# Altium project STM32F407VG.PrjPCB
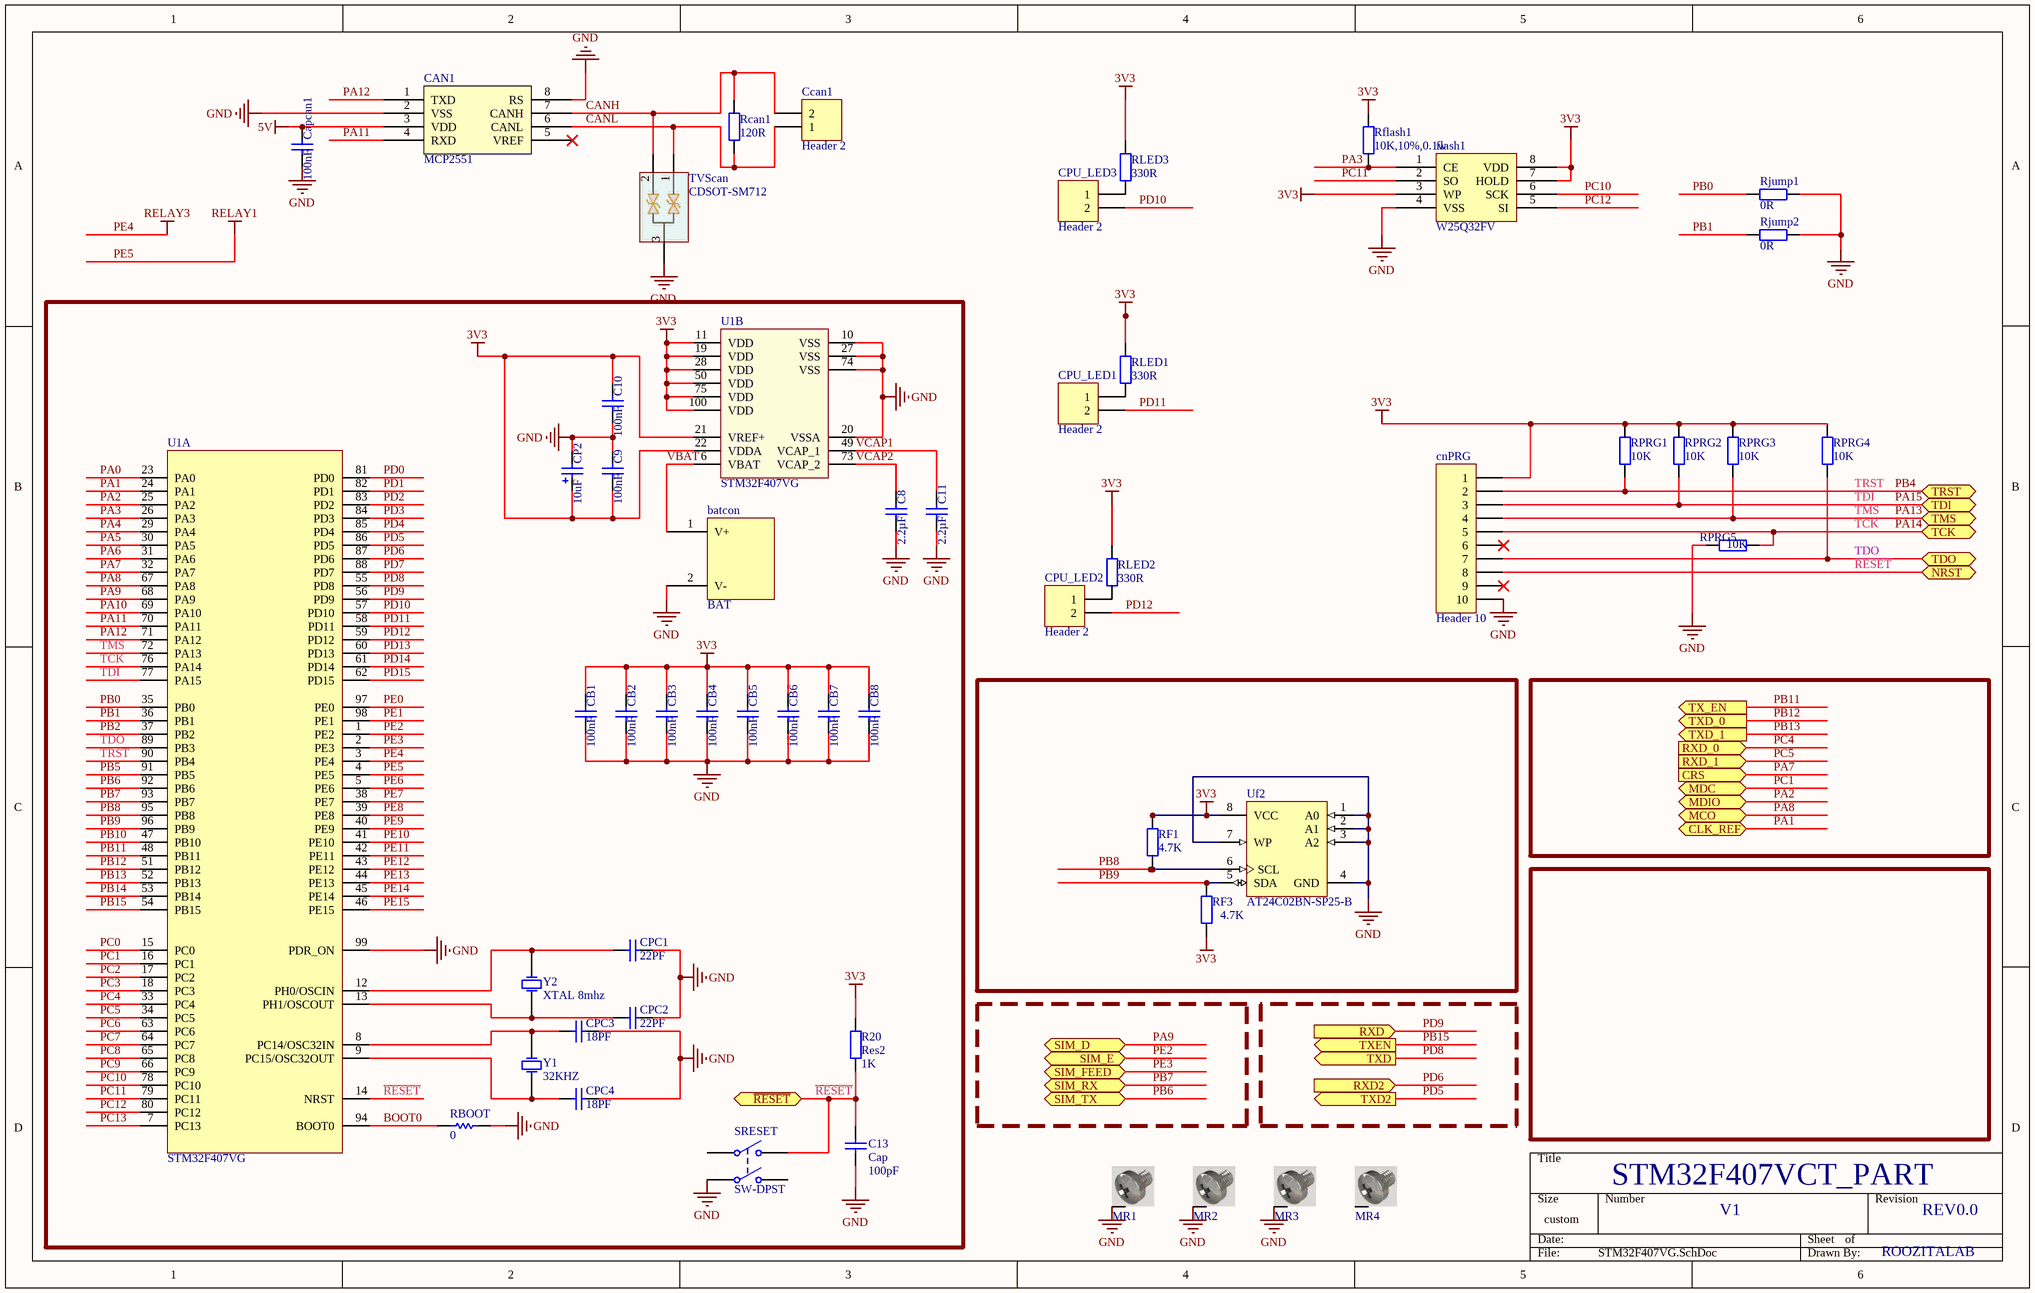
[diagram p0: STM32F407VG.SchDoc]
6 sheets, 157 parts. Net scope: flat (ports and power ports of the same name join across sheets).
Board file: CORTEXM4.PcbDoc
Sheets:
  STM32F407VG.SchDoc
  POWER_PART.SchDoc
  PROTOCOL_PART.SchDoc
  ETH_PART.SchDoc
  SIM800.SchDoc
  OUTPUTS.SchDoc

## Sheet STM32F407VG.SchDoc
size 381 x 241 mm

### Parts
batcon  BAT  [BATTERY]
C8  2.2µF  [0805.]
C9  100nF  [0805.]
C10  100nF  [0805.]
C11  2.2µF  [0805.]
C13  Cap  value 100pF  [0805.]
CAN1  MCP2551  [SOIC8]
Capcan1  100nF  [0805.]
CB1  100nF  [0805.]
CB2  100nF  [0805.]
CB3  100nF  [0805.]
CB4  100nF  [0805.]
CB5  100nF  [0805.]
CB6  100nF  [0805.]
CB7  100nF  [0805.]
CB8  100nF  [0805.]
Ccan1  Header 2  [HDR1X2]
cnPRG  Header 10  [HDR1X10]
CP2  10uF  [C1206.]
CPC1  22PF  [0805.]
CPC2  22PF  [0805.]
CPC3  18PF  [0805.]
CPC4  18PF  [0805.]
CPU_LED1  Header 2  [HDR1X2]
CPU_LED2  Header 2  [HDR1X2]
CPU_LED3  Header 2  [HDR1X2]
flash1  W25Q32FV  [SOIC8]
MR1  Screw  [Board Screw]  (value not drawn)
MR2  Screw  [Board Screw]  (value not drawn)
MR3  Screw  [Board Screw]  (value not drawn)
MR4  Screw  [Board Screw]  (value not drawn)
R20  Res2  value 1K  [0805.]
RBOOT  0  [0805.]
Rcan1  value 120R  [0805.]  (hidden comment: 120R,10%,0.1w)
RF1  value 4.7K  [0805.]  (hidden comment: Res2)
RF3  value 4.7K  [0805.]  (hidden comment: Res2)
Rflash1  10K,10%,0.1w  [0805.]
Rjump1  value 0R  [0805.]  (hidden comment: 10K,10%,0.1w)
Rjump2  value 0R  [0805.]  (hidden comment: 10K,10%,0.1w)
RLED1  value 330R  [0805.]  (hidden comment: 330R,10%,0.1w)
RLED2  value 330R  [0805.]  (hidden comment: 330R,10%,0.1w)
RLED3  value 330R  [0805.]  (hidden comment: 330R,10%,0.1w)
RPRG1  value 10K  [0805.]  (hidden comment: Res2)
RPRG2  value 10K  [0805.]  (hidden comment: Res2)
RPRG3  value 10K  [0805.]  (hidden comment: Res2)
RPRG4  value 10K  [0805.]  (hidden comment: Res2)
RPRG5  value 10K  [0805.]  (hidden comment: Res2)
SRESET  SW-DPST  [B3FS_SWITCH]
TVScan  CDSOT-SM712  [2N3906_SMD]
U1  STM32F407VG  [stm32f107]  (parts A,B of 2)
Uf2  AT24C02BN-SP25-B  [SOP8]
Y1  32KHZ  [XTAL-RTC-RA]
Y2  XTAL 8mhz  [XTAL Small]

### Ports
CLK_REF (bidir), CRS (in), MCO (bidir), MDC (bidir), MDIO (bidir), NRST (bidir), RXD2 (in), RXD (in), RXD_0 (in), RXD_1 (in), SIM_D (bidir), SIM_E (bidir), SIM_FEED (bidir), SIM_RX (bidir), SIM_TX (bidir), TCK (bidir), TDI (bidir), TDO (bidir), TMS (bidir), TRST (bidir), TX_EN (out), TXD2 (out), TXD (out), TXD_0 (out), TXD_1 (out), TXEN (out), ~{RESET} (bidir)

### Nets
3V3: C9.1 C10.2 CB1.2 CB2.2 CB3.2 CB4.2 CB5.2 CB6.2 CB7.2 CB8.2 cnPRG.1 CP2.1 flash1.3(WP) flash1.7(HOLD) flash1.8(VDD) R20.2 RF1.1 RF3.2 Rflash1.1 RLED1.2 RLED2.2 RLED3.2 RPRG1.1 RPRG2.1 RPRG3.1 RPRG4.1 U1.11(VDD) U1.19(VDD) U1.21(VREF+) U1.22(VDDA) U1.28(VDD) U1.50(VDD) U1.75(VDD) U1.100(VDD) Uf2.8(VCC)
5V: CAN1.3(VDD) Capcan1.2  [project net +5V]
GND: batcon.2(V-) C8.1 C9.2 C10.1 C11.1 C13.1 CAN1.2(VSS) CAN1.8(RS) Capcan1.1 CB1.1 CB2.1 CB3.1 CB4.1 CB5.1 CB6.1 CB7.1 CB8.1 cnPRG.10 CP2.2 CPC1.2 CPC2.2 CPC3.2 CPC4.2 flash1.4(VSS) MR1.S MR2.S MR3.S RBOOT.2 Rjump1.2 Rjump2.2 RPRG5.2 SRESET.3(COMMON2) TVScan.3 U1.10(VSS) U1.20(VSSA) U1.27(VSS) U1.74(VSS) U1.99(PDR_ON) Uf2.1(A0) Uf2.2(A1) Uf2.3(A2) Uf2.4(GND) Uf2.7(WP)
PE4: U1.3(PE4)  [also labelled RELAY3]
PE5: U1.4(PE5)  [also labelled RELAY1]
~{RESET}: C13.2 cnPRG.8 R20.1 SRESET.2(NO1) U1.14(NRST) ; port ~{RESET}, port NRST
BOOT0: RBOOT.1 U1.94(BOOT0)
CANH: CAN1.7(CANH) Ccan1.2 Rcan1.2 TVScan.2
CANL: CAN1.6(CANL) Ccan1.1 Rcan1.1 TVScan.1
PA0: U1.23(PA0)
PA1: U1.24(PA1) ; port CLK_REF
PA2: U1.25(PA2) ; port MDIO
PA3: flash1.1(CE) Rflash1.2 U1.26(PA3)
PA4: U1.29(PA4)
PA5: U1.30(PA5)
PA6: U1.31(PA6)
PA7: U1.32(PA7) ; port CRS
PA8: U1.67(PA8) ; port MCO
PA9: U1.68(PA9) ; port SIM_D
PA10: U1.69(PA10)
PA11: CAN1.4(RXD) U1.70(PA11)
PA12: CAN1.1(TXD) U1.71(PA12)
PA13: cnPRG.4 RPRG3.2 U1.72(PA13) ; port TMS  [also labelled TMS]
PA14: cnPRG.5 RPRG5.1 U1.76(PA14) ; port TCK  [also labelled TCK]
PA15: cnPRG.3 RPRG2.2 U1.77(PA15) ; port TDI  [also labelled TDI]
PB0: Rjump1.1 U1.35(PB0)
PB1: Rjump2.1 U1.36(PB1)
PB2: U1.37(PB2)
PB4: cnPRG.2 RPRG1.2 U1.90(PB4) ; port TRST  [also labelled TRST]
PB5: U1.91(PB5)
PB6: U1.92(PB6) ; port SIM_TX
PB7: U1.93(PB7) ; port SIM_RX
PB8: RF1.2 U1.95(PB8) Uf2.6(SCL)
PB9: RF3.1 U1.96(PB9) Uf2.5(SDA)
PB10: U1.47(PB10)
PB11: U1.48(PB11) ; port TX_EN
PB12: U1.51(PB12) ; port TXD_0
PB13: U1.52(PB13) ; port TXD_1
PB14: U1.53(PB14)
PB15: U1.54(PB15) ; port TXEN
PC0: U1.15(PC0)
PC1: U1.16(PC1) ; port MDC
PC2: U1.17(PC2)
PC3: U1.18(PC3)
PC4: U1.33(PC4) ; port RXD_0
PC5: U1.34(PC5) ; port RXD_1
PC6: U1.63(PC6)
PC7: U1.64(PC7)
PC8: U1.65(PC8)
PC9: U1.66(PC9)
PC10: flash1.6(SCK) U1.78(PC10)
PC11: flash1.2(SO) U1.79(PC11)
PC12: flash1.5(SI) U1.80(PC12)
PC13: U1.7(PC13)
PD0: U1.81(PD0)
PD1: U1.82(PD1)
PD2: U1.83(PD2)
PD3: U1.84(PD3)
PD4: U1.85(PD4)
PD5: U1.86(PD5) ; port TXD2
PD6: U1.87(PD6) ; port RXD2
PD7: U1.88(PD7)
PD8: U1.55(PD8) ; port TXD
PD9: U1.56(PD9) ; port RXD
PD10: CPU_LED3.2 U1.57(PD10)
PD11: CPU_LED1.2 U1.58(PD11)
PD12: CPU_LED2.2 U1.59(PD12)
PD13: U1.60(PD13)
PD14: U1.61(PD14)
PD15: U1.62(PD15)
PE0: U1.97(PE0)
PE1: U1.98(PE1)
PE2: U1.1(PE2) ; port SIM_E
PE3: U1.2(PE3) ; port SIM_FEED
PE6: U1.5(PE6)
PE7: U1.38(PE7)
PE8: U1.39(PE8)
PE9: U1.40(PE9)
PE10: U1.41(PE10)
PE11: U1.42(PE11)
PE12: U1.43(PE12)
PE13: U1.44(PE13)
PE14: U1.45(PE14)
PE15: U1.46(PE15)
TDO: cnPRG.7 RPRG4.2 U1.89(PB3) ; port TDO
VBAT: batcon.1(V+) U1.6(VBAT)
VCAP1: C11.2 U1.49(VCAP_1)
VCAP2: C8.2 U1.73(VCAP_2)
NetCPC1_1: CPC1.1 U1.12(PH0/OSCIN) Y2.2(OSC2)
NetCPC2_1: CPC2.1 U1.13(PH1/OSCOUT) Y2.1(OSC1)
NetCPC3_1: CPC3.1 U1.8(PC14/OSC32IN) Y1.2(OSC2)
NetCPC4_1: CPC4.1 U1.9(PC15/OSC32OUT) Y1.1(OSC1)
NetCPU_LED1_1: CPU_LED1.1 RLED1.1
NetCPU_LED2_1: CPU_LED2.1 RLED2.1
NetCPU_LED3_1: CPU_LED3.1 RLED3.1

Not connected (* = marked no-connect by the designer): CAN1 5(VREF)*; cnPRG 6* 9*; MR4 S; SRESET 1(COMMON1) 4(NO2)

### Notes on the sheet
- STM32F407VCT_PART
- V1
- REV0.0
- ROOZITALAB

### Library data of the parts
C8-C11 C13 Capcan1 CB1-CB8 CPC1-CPC4 = Cap: Capacitor; Published: 8-Jun-2000; LatestRevisionDate: 17-Jul-2002; LatestRevisionNote: Re-released for DXP Platform.; PackageReference: RAD-0.3; Publisher: Altium Limited; PackageDescription: Radial Cap, Thru-Hole; 2 Leads; 0.3 in Pin Spacing
  C8 C11: Value: 2.2µF
  C9 C10 Capcan1 CB1-CB8: Value: 100nF
  CPC1 CPC2: Value: 22PF
  CPC3 CPC4: Value: 18PF
CAN1 = SN65VHD230
Ccan1 CPU_LED1-CPU_LED3 = Header 2: Header, 2-Pin; LatestRevisionDate: 17-Jul-2002; LatestRevisionNote: Re-released for DXP Platform.; Publisher: Altium Limited
cnPRG = Header 10: Header, 10-Pin; LatestRevisionDate: 17-Jul-2002; LatestRevisionNote: Re-released for DXP Platform.; Publisher: Altium Limited
CP2 = Cap Pol1: Polarized Capacitor (Radial); Published: 8-Jun-2000; Revision: July-2002: Re-released for DXP Platform.; Publisher: Altium Limited; Value: 10uF
flash1 = SST25
MR1-MR4 = Board Screw: Board Screw With Spacer
R20 Rcan1 RF1 RF3 Rflash1 Rjump1 Rjump2 RLED1-RLED3 RPRG1-RPRG5 = Res2: Resistor; Published: 8-Jun-2000; LatestRevisionDate: 17-Jul-2002; LatestRevisionNote: Re-released for DXP Platform.; PackageReference: AXIAL-0.4; Publisher: Altium Limited
  R20 RF1 RF3 Rjump1 Rjump2 RPRG1-RPRG5: PackageDescription: Axial Device, Thru-Hole; 2 Leads; 0.4 in Pin Spacing
RBOOT = Res1: Resistor; Value: 1K; Published: 8-Jun-2000; Revision: July-2002: Re-released for DXP Platform.; Publisher: Altium Limited
SRESET = SW-DPST: Double-Pole, Single-Throw Switch; Published: 24-Mar-1999; LatestRevisionDate: 17-Jul-2002; LatestRevisionNote: Re-released for DXP Platform.; PackageReference: DPST-4; Publisher: Altium Limited
TVScan = nup2105
Uf2 = AT24C02BN-SP25-B: 2Kbit (256 x 8), 2-wire Bus Automotive Serial EEPROM with full memory Write Protect, 2.5V, 8-Pin SOIC, Bulk; Published: 20-Sep-2010; DatasheetVersion: 8517C,  Jan-2009; PackageVersion: revC, Mar-2005; PackageReference: 8S1; Publisher: Altium Limited; PackageDescription: 8-Lead (0.150" Wide Body), Plastic Gull Wing Small Outline (JEDEC SOIC); Code_JEDEC: MS-012-AA; Code_IPC: SOIC127P600-8; ComponentLink1Description: Manufacturer Link; ComponentLink1URL: http://www.atmel.com/products/serial/default.asp; ComponentLink2Description: Datasheet; ComponentLink2URL: http://www.atmel.com/dyn/resources/prod_documents/doc8517.pdf; ComponentLink3Description: Atmel.com Home; ComponentLink3URL: http://www.atmel.com
Y1 = XTAL_1: Crystal Oscillator; Published: 8-Jun-2000; LatestRevisionDate: 17-Jul-2002; LatestRevisionNote: Re-released for DXP Platform.; PackageReference: R38; Publisher: Altium Limited
Y2 = XTAL: Crystal Oscillator; Published: 8-Jun-2000; LatestRevisionDate: 17-Jul-2002; LatestRevisionNote: Re-released for DXP Platform.; PackageReference: R38; Publisher: Altium Limited

## Sheet POWER_PART.SchDoc
size A4
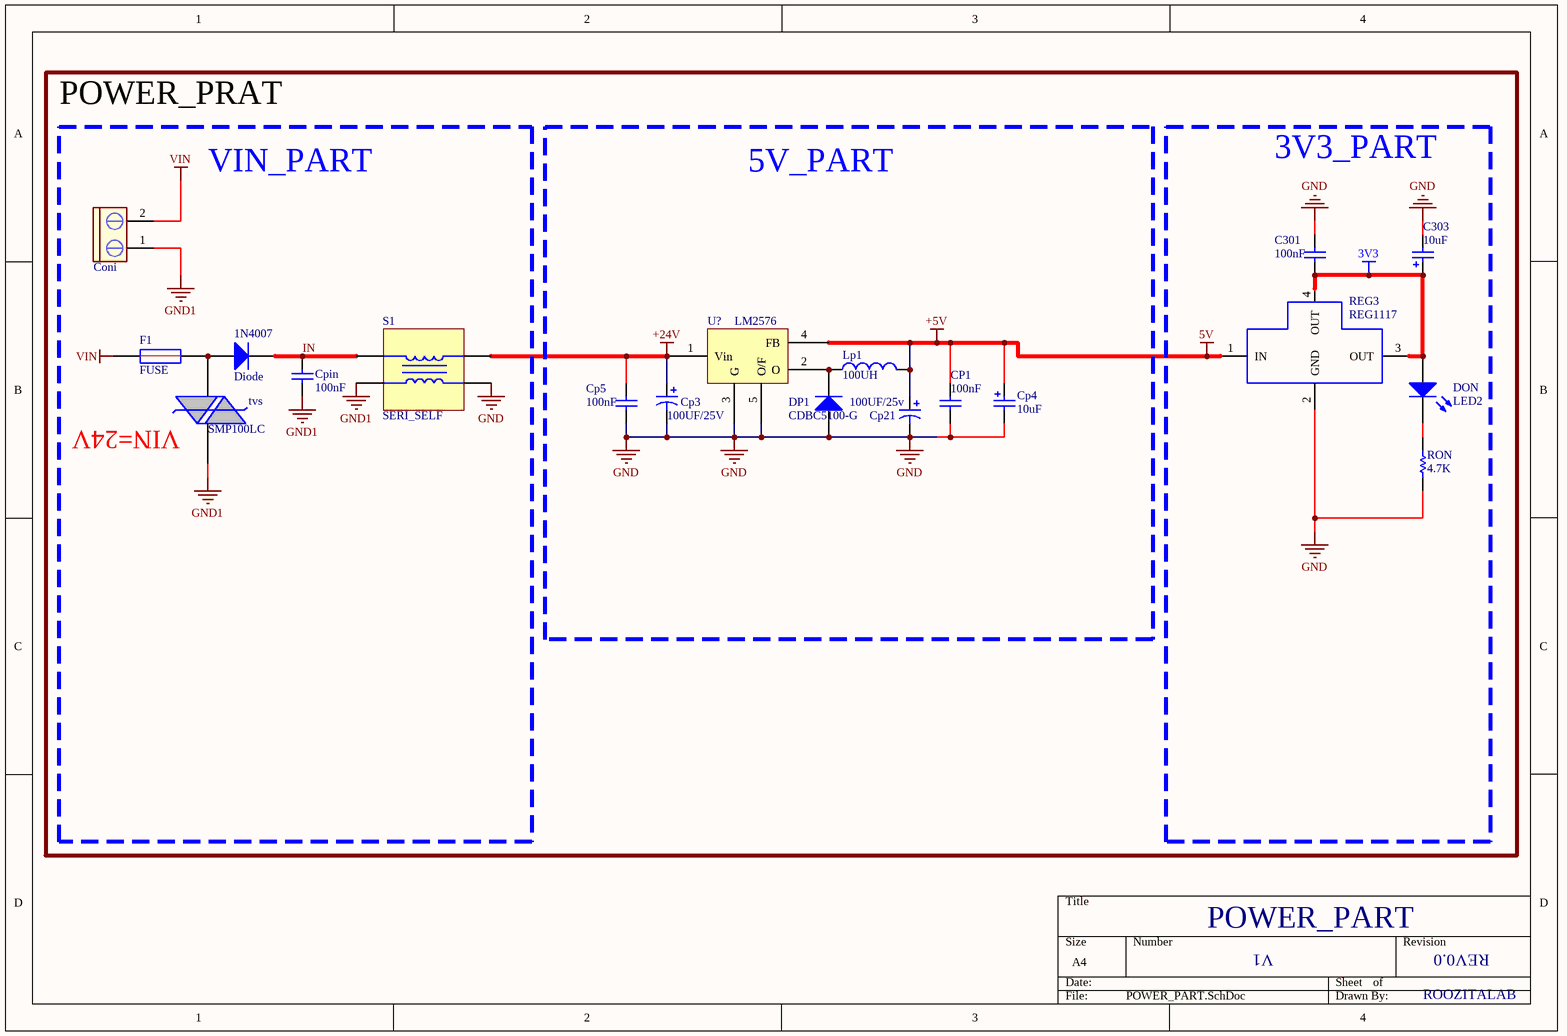
[diagram p1: POWER_PART.SchDoc]

### Parts
1N4007  Diode  [SMB]
C301  100nF  [0805.]
C303  10uF  [C1206.]
Coni  CON2 pin blue  [My_CN2]  (value not drawn)
CP1  100nF  [0805.]
Cp3  value 100UF/25V  [100UF25V]  (hidden comment: Cap Pol1)
Cp4  10uF  [C1206.]
Cp5  100nF  [0805.]
Cp21  value 100UF/25v  [100UF25V]  (hidden comment: Cap Pol1)
Cpin  100nF  [0805.]
DON  LED2  [0805.]
DP1  CDBC5100-G  [MY_SMC]
F1  FUSE  [1206]
Lp1  value 100UH  [indoctor100u]  (hidden comment: Inductor)
REG3  REG1117  [REG SMD]
RON  4.7K  [0805.]
S1  SERI_SELF  [SERI_SELF_SMALL]
tvs  SMP100LC  [TVS]
U?  LM2576  [d2pak5-lead]

### Nets
3V3: C301.1 C303.1 DON.1(A) REG3.3(OUT) REG3.4(OUT)
+5V: CP1.2 Cp4.1 Cp21.1 Lp1.2 REG3.1(IN) U?.4(FB)  [also labelled 5V]
+24V: Cp3.1 Cp5.2 S1.3 U?.1(Vin)
GND: C301.2 C303.2 CP1.1 Cp3.2 Cp4.2 Cp5.1 Cp21.2 DP1.A REG3.2(GND) RON.1 S1.4 U?.3(G) U?.5(O/F)
GND1: Coni.1 Cpin.2 S1.2 tvs.2
VIN: Coni.2 F1.2
IN: 1N4007.2(K) Cpin.1 S1.1
Net1N4007_1: 1N4007.1(A) F1.1 tvs.1
NetDON_2: DON.2(K) RON.2
NetDP1_K: DP1.K Lp1.1 U?.2(O)

### Notes on the sheet
- POWER_PRAT
- VIN_PART
- 5V_PART
- 3V3_PART
- (near tvs) VIN=24V
- POWER_PART
- V1
- REV0.0
- ROOZITALAB

### Library data of the parts
1N4007 = Diode: Default Diode; Published: 8-Jun-2000; LatestRevisionDate: 17-Jul-2002; LatestRevisionNote: Re-released for DXP Platform.; PackageVersion: Sep-1996; PackageReference: SMC; Publisher: Altium Limited; PackageDescription: DO-214-AB/SMC; 2 C-Bend Leads; Body 7.9 x 5.9 mm, inc. leads (LxW); Code_JEDEC: DO-214-AB
C301 CP1 Cp5 Cpin = Cap: Capacitor; Published: 8-Jun-2000; LatestRevisionDate: 17-Jul-2002; LatestRevisionNote: Re-released for DXP Platform.; PackageReference: RAD-0.3; Publisher: Altium Limited; PackageDescription: Radial Cap, Thru-Hole; 2 Leads; 0.3 in Pin Spacing; Value: 100nF
C303 Cp3 Cp4 Cp21 = Cap Pol1: Polarized Capacitor (Radial); Published: 8-Jun-2000; Publisher: Altium Limited
  C303 Cp4: Revision: July-2002: Re-released for DXP Platform.; Value: 10uF
  Cp3 Cp21: LatestRevisionDate: 17-Jul-2002; LatestRevisionNote: Re-released for DXP Platform.; PackageReference: RB7.6-15
Coni = CON2 pin blue: Connector blue screw
DON = LED2: Typical RED, GREEN, YELLOW, AMBER GaAs LED; Published: 8-Jun-2000; LatestRevisionDate: 17-Jul-2002; LatestRevisionNote: Re-released for DXP Platform.; PackageVersion: Feb-2002; PackageReference: 3.2X1.6X1.1; Publisher: Altium Limited; PackageDescription: SM LED; 2 Flat Leads
DP1 = 1N4007: 1 Amp Diode
Lp1 = Inductor: Code_IEC: 1005; Published: 8-Jun-2000; LatestRevisionDate: 17-Jul-2002; LatestRevisionNote: Re-released for DXP Platform.; PackageReference: 0402-A; Publisher: Altium Limited; Code_JEITA: 0402
RON = Res1: Resistor; Value: 1K; Published: 8-Jun-2000; Revision: July-2002: Re-released for DXP Platform.; Publisher: Altium Limited
U? = LM2576-5V

## Sheet PROTOCOL_PART.SchDoc
size A
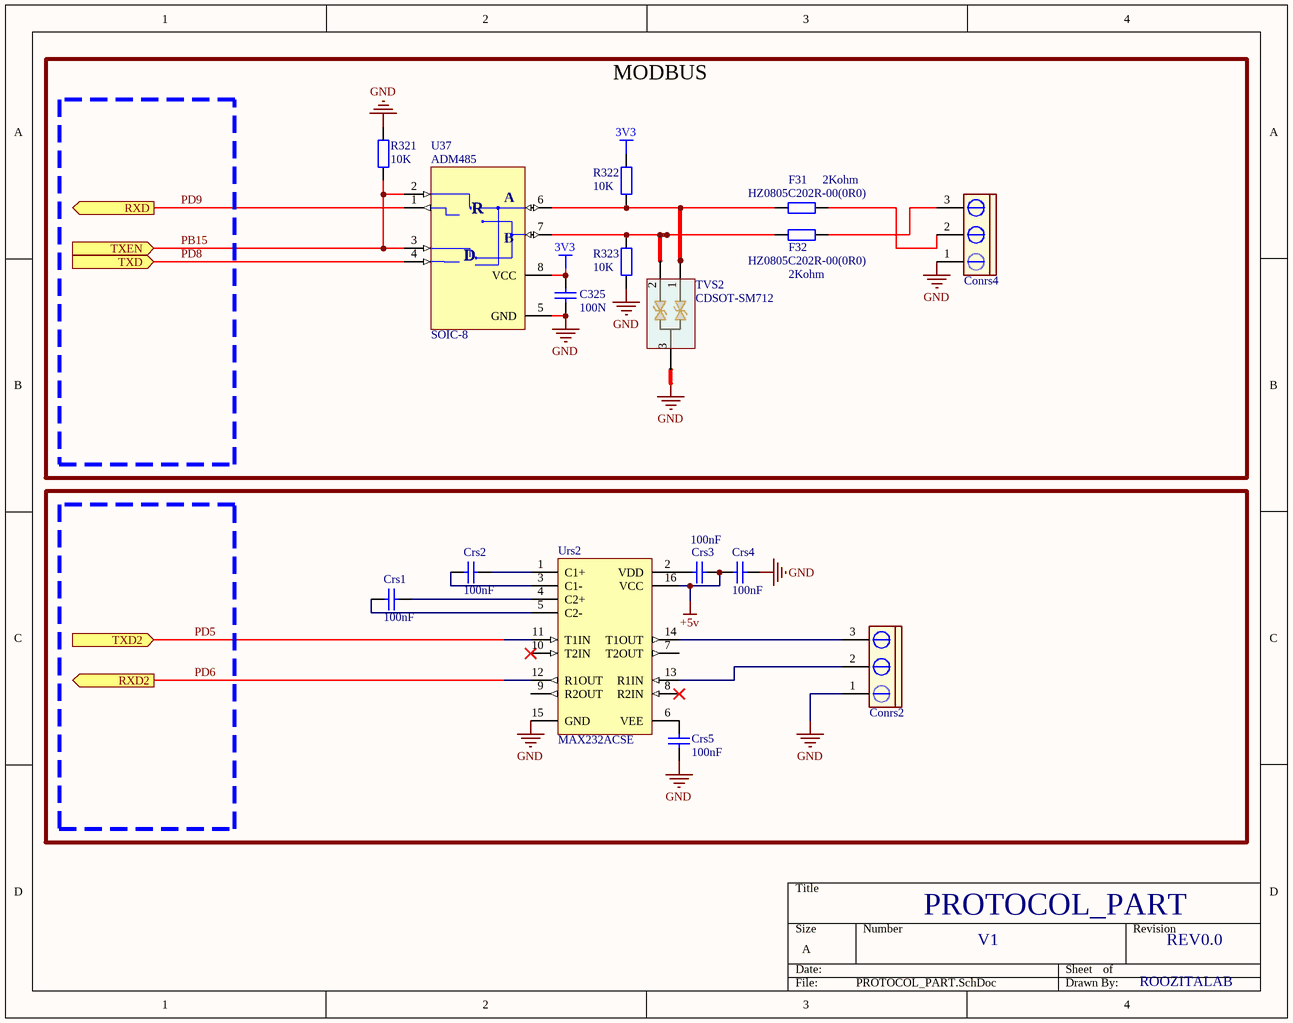
[diagram p2: PROTOCOL_PART.SchDoc]

### Parts
C325  value 100N  [0805.]
Conrs2  CON3 pin Green  [My_CN3]  (value not drawn)
Conrs4  CON3 pin Green  [My_CN3]  (value not drawn)
Crs1  value 100nF  [CAP 1206 (3216X08L)]  (hidden comment: Cap)
Crs2  value 100nF  [CAP 1206 (3216X08L)]  (hidden comment: Cap)
Crs3  value 100nF  [CAP 1206 (3216X08L)]  (hidden comment: Cap)
Crs4  value 100nF  [CAP 1206 (3216X08L)]  (hidden comment: Cap)
Crs5  value 100nF  [CAP 1206 (3216X08L)]  (hidden comment: Cap)
F31  HZ0805C202R-00(0R0)  [0805.]
F32  HZ0805C202R-00(0R0)  [0805.]
R321  value 10K  [0805.]
R322  value 10K  [0805.]
R323  value 10K  [0805.]
TVS2  CDSOT-SM712  [2N3906_SMD]
U37  ADM485  [SOIC8]
Urs2  MAX232ACSE  [SOIC16]

### Blocks framed on the sheet
MODBUS: C325 Conrs4 F31 F32 R321-R323 TVS2 U37

### Ports
RXD2 (out), RXD (out), TXD2 (in), TXD (in), TXEN (in)

### Nets
3V3: C325.2 R322.1 U37.8(VCC)
+5V: Crs3.1 Crs4.2 Urs2.16(VCC)
GND: C325.1 Conrs2.1 Conrs4.1 Crs4.1 Crs5.1 R321.1 R323.2 TVS2.3 U37.5(GND) Urs2.15(GND)
PB15: R321.2 U37.2(~{RE}) U37.3(DE) ; port TXEN
PD5: Urs2.11(T1IN) ; port TXD2
PD6: Urs2.12(R1OUT) ; port RXD2
PD8: U37.4(DI) ; port TXD
PD9: U37.1(RO) ; port RXD
NetConrs2_2: Conrs2.2 Urs2.13(R1IN)
NetConrs2_3: Conrs2.3 Urs2.14(T1OUT)
NetConrs4_2: Conrs4.2 F31.2
NetConrs4_3: Conrs4.3 F32.2
NetCrs1_1: Crs1.1 Urs2.5(C2-)
NetCrs1_2: Crs1.2 Urs2.4(C2+)
NetCrs2_1: Crs2.1 Urs2.1(C1+)
NetCrs2_2: Crs2.2 Urs2.3(C1-)
NetCrs3_2: Crs3.2 Urs2.2(VDD)
NetCrs5_2: Crs5.2 Urs2.6(VEE)
NetF31_1: F31.1 R322.2 TVS2.1 U37.6(A)
NetF32_1: F32.1 R323.1 TVS2.2 U37.7(B)

Not connected (* = marked no-connect by the designer): Urs2 7(T2OUT) 8(R2IN)* 9(R2OUT) 10(T2IN)*

### Notes on the sheet
- (near F31) 2Kohm
- (near F32) 2Kohm
- (near U37) SOIC-8
- PROTOCOL_PART
- V1
- REV0.0
- ROOZITALAB
- (in symbol MAX485EPA) R; D

### Library data of the parts
C325 = Cap: Capacitor; Manufacturer: Generic Components; Class: Passive; Published: 08/06/2000; Publisher: Altium Hobart Technology Centre; SubClass: Capacitor
Conrs2 Conrs4 = CON3 pin Green: Connector green screw
Crs1-Crs5 = Cap: Capacitor; Published: 8-Jun-2000; LatestRevisionDate: 17-Jul-2002; LatestRevisionNote: Re-released for DXP Platform.; PackageReference: RAD-0.3; Publisher: Altium Limited
F31 F32 = Res2: Resistor; Published: 8-Jun-2000; Revision: July-2002: Re-released for DXP Platform.; Publisher: Altium Limited
R321-R323 = Res2: Resistor; Manufacturer: Generic Components; Class: Passive; Published: 08/06/2000; Publisher: Altium Hobart Technology Centre; SubClass: Resistor
TVS2 = nup2105
U37 = MAX485EPA: Low-Power, Slew-Rate-Limited RS-485/RS-422 Transceiver; Manufacturer: Maxim; Class: Communication; Published: 16/01/2001; Publisher: Altium Hobart Technology Centre; SubClass: Transceiver
Urs2 = MAX232ACSE: +5V Powered, Multi-Channel RS-232 Driver/Receiver; Published: 16-Jan-2001; LatestRevisionDate: 13-Apr-2006; LatestRevisionNote: IPC-7351 Footprint Added.; PackageReference: NSO16; Publisher: Altium Limited; PackageDescription: 16-Pin Small Outline Integrated Circuit 1.27 mm Pitch; Code_JEDEC: MS-012-AC; Code_IPC: SOIC127P600-16; ComponentLink1Description: Manufacturer Link; ComponentLink1URL: http://www.maxim-ic.com/; ComponentLink2Description: Datasheet; ComponentLink2URL: http://pdfserv.maxim-ic.com/en/ds/MAX220-MAX249.pdf

## Sheet ETH_PART.SchDoc
size A4; SheetTotal: 8
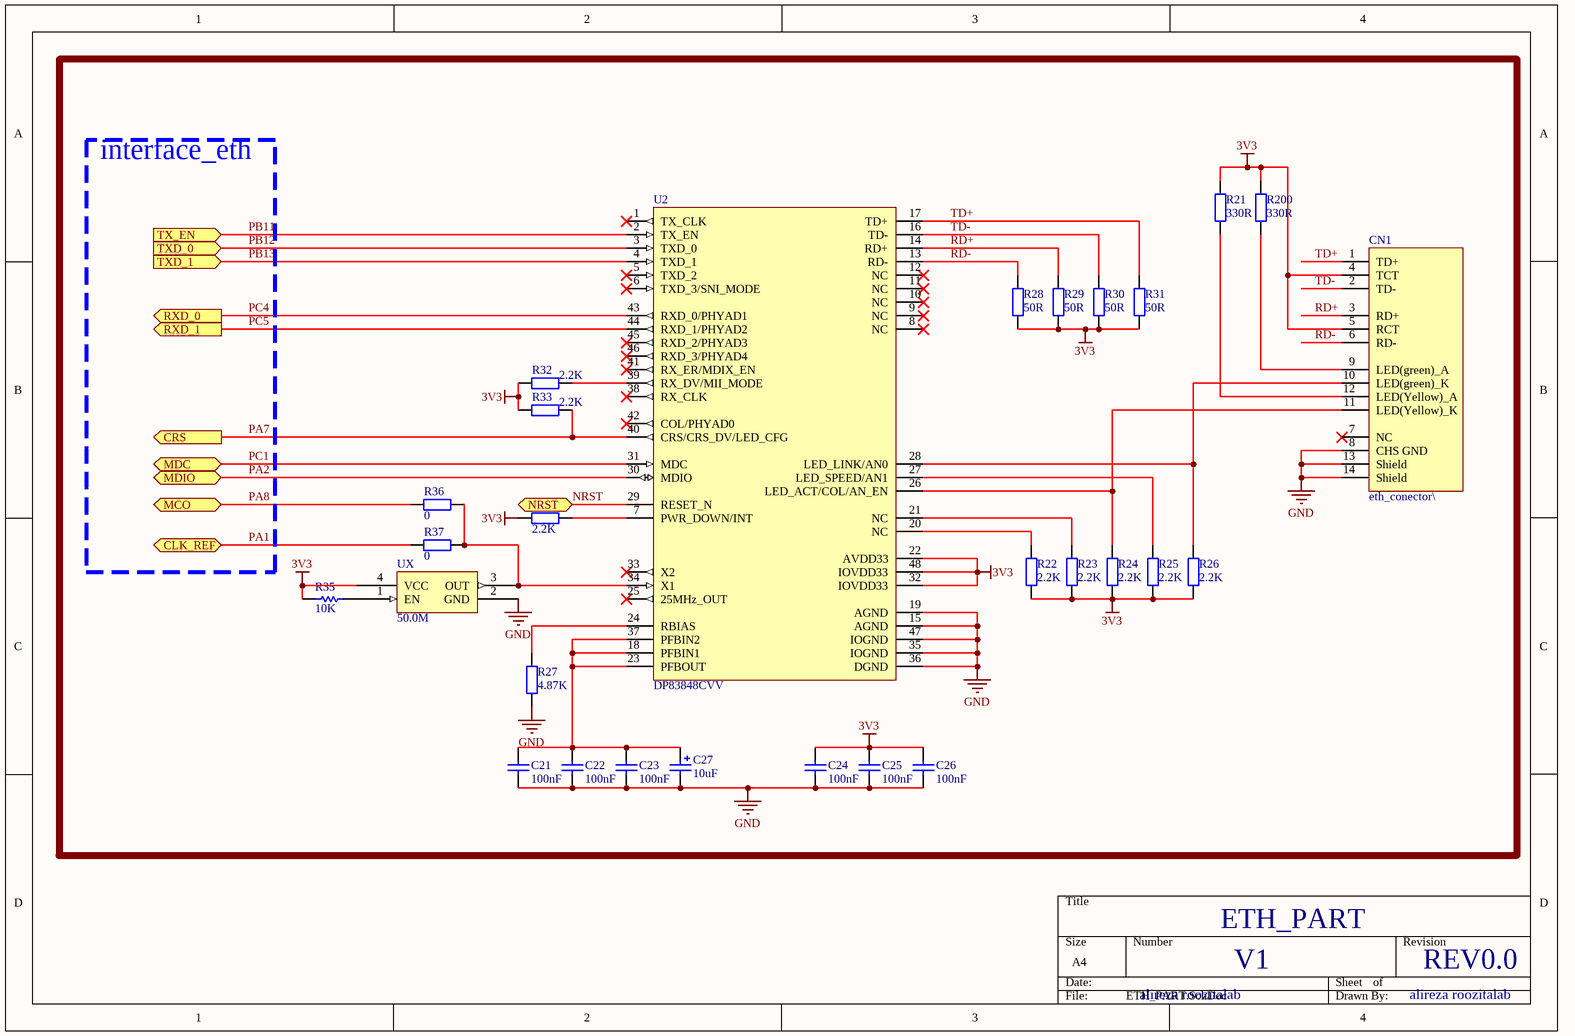
[diagram p3: ETH_PART.SchDoc]

### Parts
C21  100nF  [0805.]
C22  100nF  [0805.]
C23  100nF  [0805.]
C24  100nF  [0805.]
C25  100nF  [0805.]
C26  100nF  [0805.]
C27  10uF  [C1206.]
CN1  eth_conector\  [eth_conector]
R21  value 330R  [0805.]  (hidden comment: Res2)
R22  value 2.2K  [0805.]  (hidden comment: Res2)
R23  value 2.2K  [0805.]  (hidden comment: Res2)
R24  value 2.2K  [0805.]  (hidden comment: Res2)
R25  value 2.2K  [0805.]  (hidden comment: Res2)
R26  value 2.2K  [0805.]  (hidden comment: Res2)
R27  value 4.87K  [0805.]  (hidden comment: Res2)
R28  value 50R  [0805.]  (hidden comment: Res2)
R29  value 50R  [0805.]  (hidden comment: Res2)
R30  value 50R  [0805.]  (hidden comment: Res2)
R31  value 50R  [0805.]  (hidden comment: Res2)
R32  value 2.2K  [0805.]  (hidden comment: Res2)
R33  value 2.2K  [0805.]  (hidden comment: Res2)
R34  value 2.2K  [0805.]  (hidden comment: Res2)
R35  10K  [0805.]
R36  value 0  [0805.]  (hidden comment: Res2)
R37  value 0  [0805.]  (hidden comment: Res2)
R200  value 330R  [0805.]  (hidden comment: Res2)
U2  DP83848CVV  [LQFP48]
UX  50.0M  [oscillator_50MHZ]

### Blocks framed on the sheet
interface_eth: C21-C27 CN1 R21-R37 R200 U2 UX

### Ports
CLK_REF (bidir), CRS (out), MCO (bidir), MDC (bidir), MDIO (bidir), NRST (bidir), RXD_0 (out), RXD_1 (out), TX_EN (in), TXD_0 (in), TXD_1 (in)

### Nets
3V3: C24.1 C25.1 C26.1 CN1.4(TCT) CN1.5(RCT) R21.2 R22.1 R23.1 R24.1 R25.1 R26.1 R28.1 R29.1 R30.1 R31.1 R32.1 R33.1 R34.1 R35.1 R200.2 U2.22(AVDD33) U2.32(IOVDD33) U2.48(IOVDD33) UX.4(VCC)
GND: C21.2 C22.2 C23.2 C24.2 C25.2 C26.2 C27.2 CN1.8(CHS_GND) CN1.13(Shield) CN1.14(Shield) R27.1 U2.15(AGND) U2.19(AGND) U2.35(IOGND) U2.36(DGND) U2.47(IOGND) UX.2(GND)
NRST: U2.29(RESET_N) ; port NRST  [project net ~{RESET}]
PA1: R37.1 ; port CLK_REF
PA2: U2.30(MDIO) ; port MDIO
PA7: R33.2 U2.40(CRS/CRS_DV/LED_CFG) ; port CRS
PA8: R36.1 ; port MCO
PB11: U2.2(TX_EN) ; port TX_EN
PB12: U2.3(TXD_0) ; port TXD_0
PB13: U2.4(TXD_1) ; port TXD_1
PC1: U2.31(MDC) ; port MDC
PC4: U2.43(RXD_0/PHYAD1) ; port RXD_0
PC5: U2.44(RXD_1/PHYAD2) ; port RXD_1
RD+: CN1.3(RD+) R29.2 U2.14(RD+)
RD-: CN1.6(RD-) R28.2 U2.13(RD-)
TD+: CN1.1(TD+) R31.2 U2.17(TD+)
TD-: CN1.2(TD-) R30.2 U2.16(TD-)
NetC21_1: C21.1 C22.1 C23.1 C27.1 U2.18(PFBIN1) U2.23(PFBOUT) U2.37(PFBIN2)
NetCN1_9: CN1.9(LED(green)_A) R200.1
NetCN1_10: CN1.10(LED(green)_K) R26.2 U2.28(LED_LINK/AN0)
NetCN1_11: CN1.11(LED(Yellow)_K) R24.2 U2.26(LED_ACT/COL/AN_EN)
NetCN1_12: CN1.12(LED(Yellow)_A) R21.1
NetR22_2: R22.2 U2.20(NC)
NetR23_2: R23.2 U2.21(NC)
NetR25_2: R25.2 U2.27(LED_SPEED/AN1)
NetR27_2: R27.2 U2.24(RBIAS)
NetR32_2: R32.2 U2.39(RX_DV/MII_MODE)
NetR34_2: R34.2 U2.7(PWR_DOWN/INT)
NetR35_2: R35.2 UX.1(EN)
NetR36_2: R36.2 R37.2 U2.34(X1) UX.3(OUT)

Not connected (* = marked no-connect by the designer): CN1 7(NC)*; U2 1(TX_CLK)* 5(TXD_2)* 6(TXD_3/SNI_MODE)* 8(NC)* 9(NC)* 10(NC)* 11(NC)* 12(NC)* 25(25MHz_OUT)* 33(X2)* 38(RX_CLK)* 41(RX_ER/MDIX_EN)* 42(COL/PHYAD0)* 45(RXD_2/PHYAD3)* 46(RXD_3/PHYAD4)*

### Notes on the sheet
- ETH_PART
- V1
- REV0.0
- alireza roozitalab

### Library data of the parts
C21-C26 = Cap: Capacitor; Published: 8-Jun-2000; LatestRevisionDate: 17-Jul-2002; LatestRevisionNote: Re-released for DXP Platform.; PackageReference: RAD-0.3; Publisher: Altium Limited; PackageDescription: Radial Cap, Thru-Hole; 2 Leads; 0.3 in Pin Spacing; Value: 100nF
C27 = Cap Pol1: Polarized Capacitor (Radial); Published: 8-Jun-2000; Revision: July-2002: Re-released for DXP Platform.; Publisher: Altium Limited; Value: 10uF
R21-R34 R36 R37 R200 = Res2: Resistor; Published: 8-Jun-2000; LatestRevisionDate: 17-Jul-2002; LatestRevisionNote: Re-released for DXP Platform.; PackageReference: AXIAL-0.4; Publisher: Altium Limited; PackageDescription: Axial Device, Thru-Hole; 2 Leads; 0.4 in Pin Spacing
R35 = Res1: Resistor; Value: 1K; Published: 8-Jun-2000; Revision: July-2002: Re-released for DXP Platform.; Publisher: Altium Limited
UX = SM7745HEV-50.0M

## Sheet SIM800.SchDoc
size A3
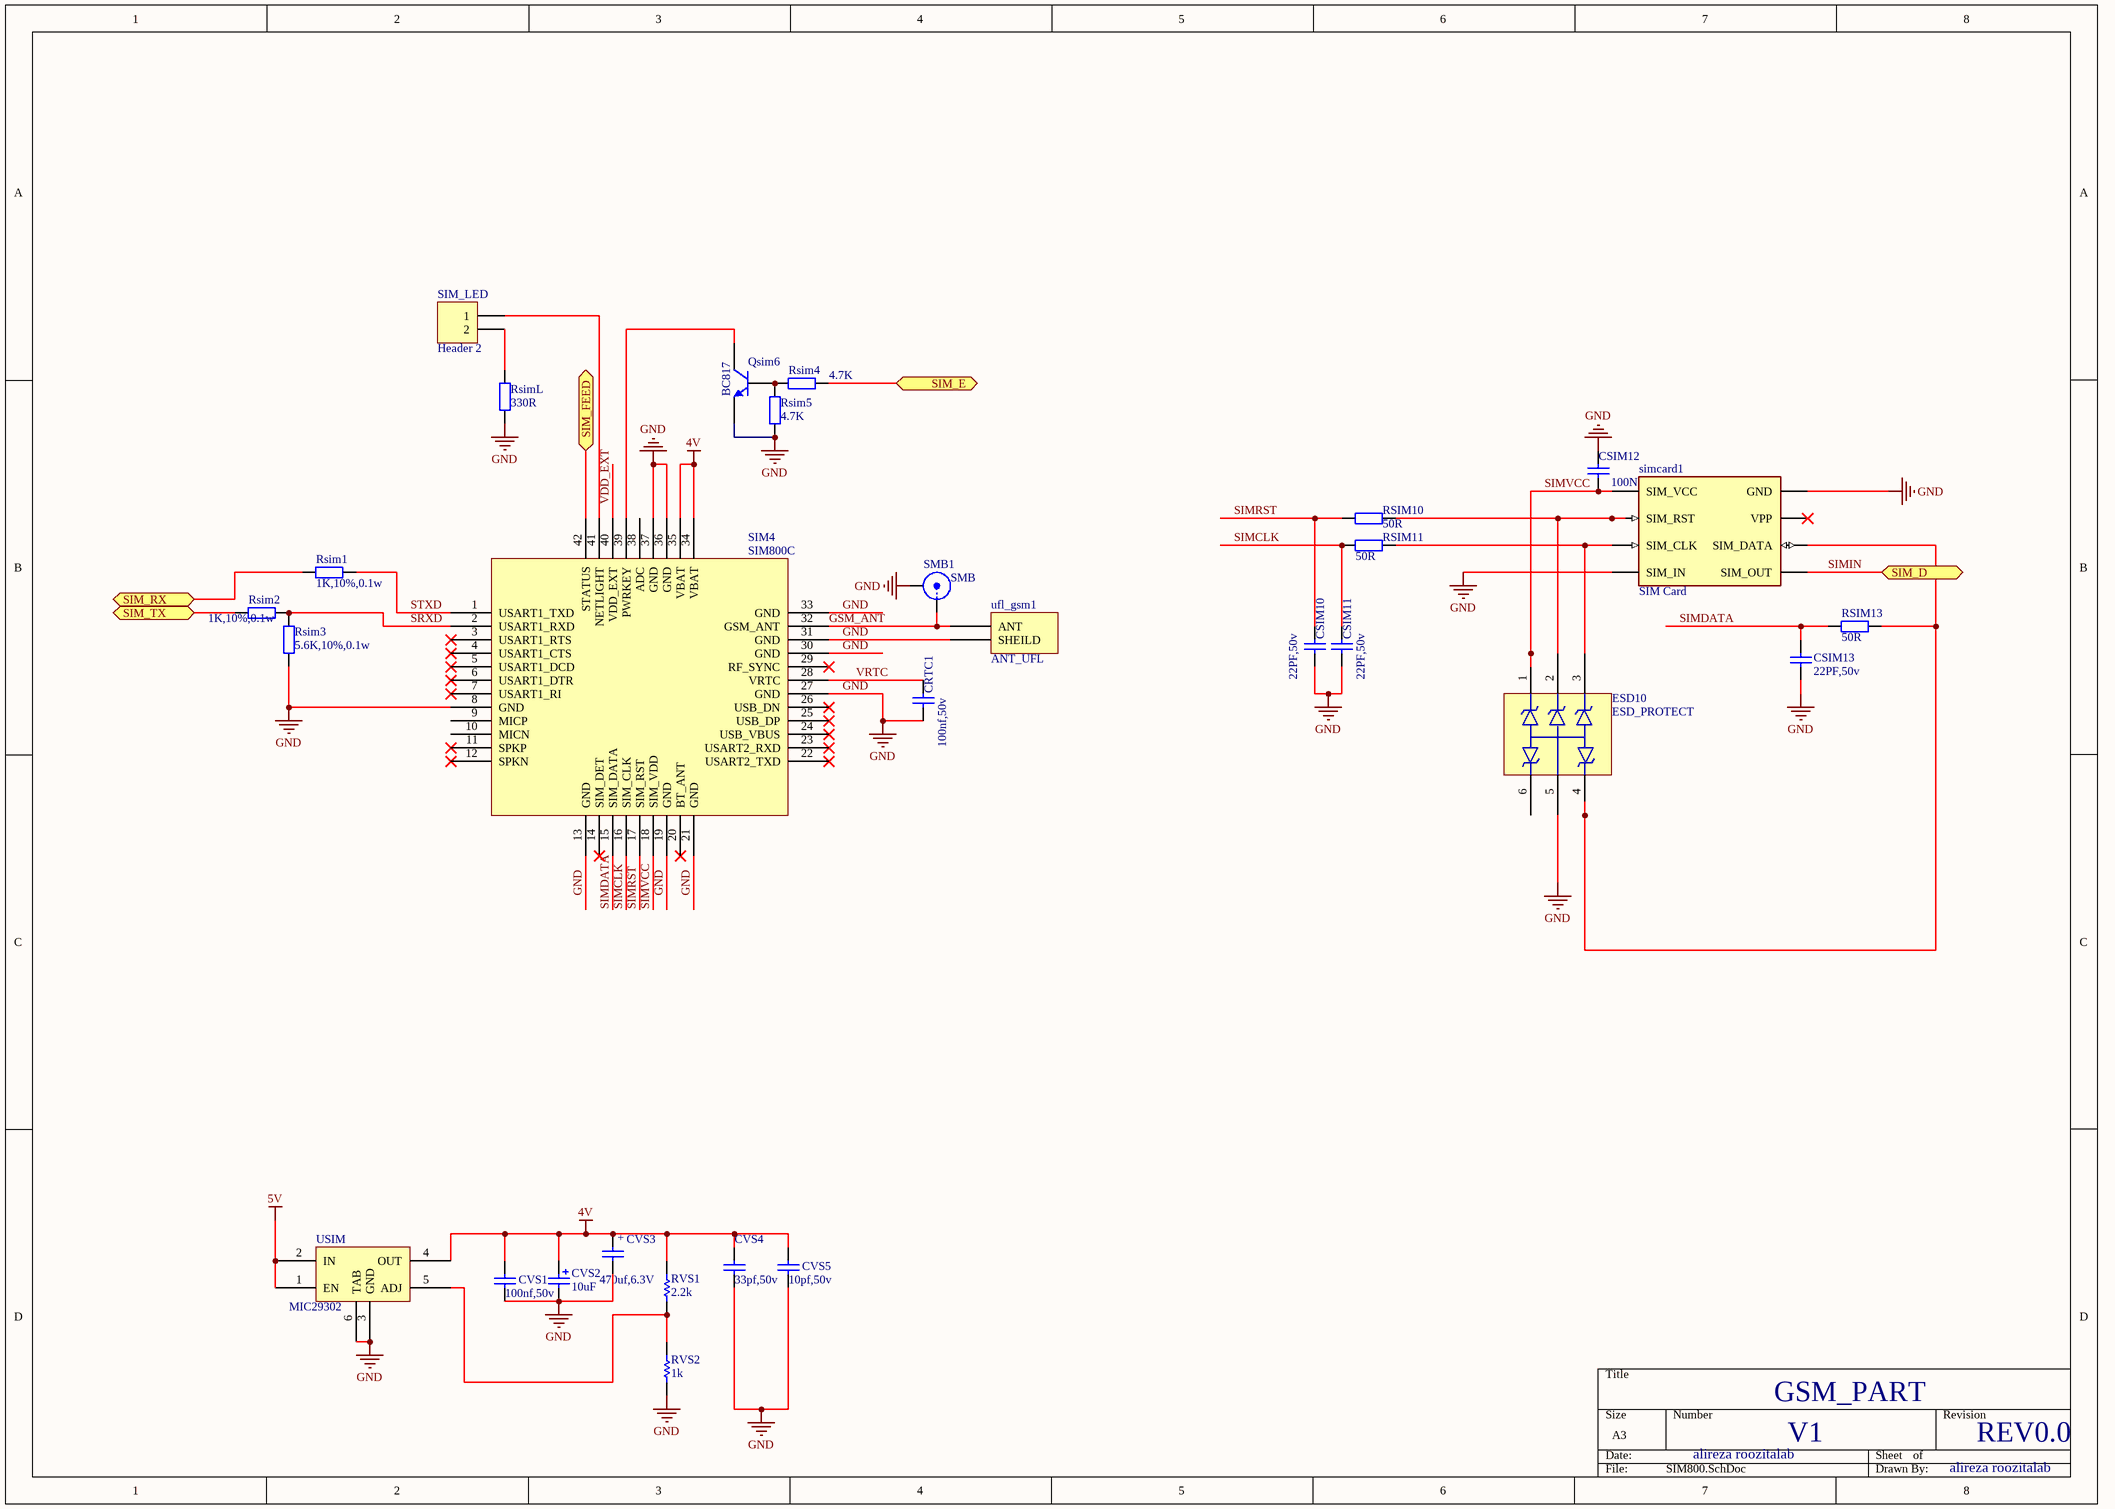
[diagram p4: SIM800.SchDoc]

### Parts
CRTC1  100nf,50v  [0805.]
CSIM10  22PF,50v  [0805.]
CSIM11  22PF,50v  [0805.]
CSIM12  100N  [0805.]
CSIM13  22PF,50v  [0805.]
CVS1  100nf,50v  [0805.]
CVS2  10uF  [C1206.]
CVS3  470uf,6.3V  [MY_SMC_D]
CVS4  33pf,50v  [0805.]
CVS5  10pf,50v  [0805.]
ESD10  ESD_PROTECT  [SMF05]
Qsim6  BC817  [2N3906_SMD]
Rsim1  1K,10%,0.1w  [0805.]
Rsim2  1K,10%,0.1w  [0805.]
Rsim3  5.6K,10%,0.1w  [0805.]
Rsim4  value 4.7K  [0805.]  (hidden comment: 10K,10%,0.1w)
Rsim5  value 4.7K  [0805.]  (hidden comment: 10K,10%,0.1w)
RSIM10  value 50R  [0805.]  (hidden comment: 47R,10%,0.1w)
RSIM11  value 50R  [0805.]  (hidden comment: 47R,10%,0.1w)
RSIM13  value 50R  [0805.]  (hidden comment: 47R,10%,0.1w)
RsimL  value 330R  [0805.]  (hidden comment: 330R,10%,0.1w)
RVS1  2.2k  [0805.]
RVS2  1k  [0805.]
SIM4  SIM800C  [SIM800C]
SIM_LED  Header 2  [HDR1X2]
simcard1  SIM Card  [MY_SIMCARD]
SMB1  SMB  [SMB_V-RJ45]
ufl_gsm1  ANT_UFL  [UFL_CON]
USIM  MIC29302  [MIC29302]

### Ports
SIM_D (bidir), SIM_E (bidir), SIM_FEED (bidir), SIM_RX (bidir), SIM_TX (bidir)

### Nets
4V: CVS1.2 CVS2.1 CVS3.+ CVS4.2 CVS5.2 RVS1.2 SIM4.34(VBAT) SIM4.35(VBAT) USIM.4(OUT)
5V: USIM.1(EN) USIM.2(IN)  [project net +5V]
GND: CRTC1.1 CSIM10.1 CSIM11.1 CSIM12.2 CSIM13.1 CVS1.1 CVS2.2 CVS3.- CVS4.1 CVS5.1 ESD10.5 Qsim6.1(E) Rsim3.1 Rsim5.1 RsimL.1 RVS2.1 SIM4.8(GND) SIM4.13(GND) SIM4.19(GND) SIM4.21(GND) SIM4.27(GND) SIM4.30(GND) SIM4.31(GND) SIM4.33(GND) SIM4.36(GND) SIM4.37(GND) simcard1.C4(SIM_IN) simcard1.C5(GND) SMB1.2(Y) ufl_gsm1.1(SHEILD) USIM.3(GND) USIM.6(TAB)
GSM_ANT: SIM4.32(GSM_ANT) SMB1.1(X) ufl_gsm1.2(ANT)
PB6: Rsim2.1 ; port SIM_TX
PB7: Rsim1.2 ; port SIM_RX
PE2: Rsim4.1 ; port SIM_E
PE3: SIM4.42(STATUS) ; port SIM_FEED
SIMCLK: CSIM11.2 RSIM11.1 SIM4.16(SIM_CLK)
SIMDATA: CSIM13.2 RSIM13.1 SIM4.15(SIM_DATA)
SIMIN: simcard1.C8(SIM_OUT) ; port SIM_D  [project net PA9]
SIMRST: CSIM10.2 RSIM10.1 SIM4.17(SIM_RST)
SIMVCC: CSIM12.1 ESD10.1 SIM4.18(SIM_VDD) simcard1.C1(SIM_VCC)
SRXD: Rsim2.2 Rsim3.2 SIM4.2(USART1_RXD)
STXD: Rsim1.1 SIM4.1(USART1_TXD)
VDD_EXT: SIM4.40(VDD_EXT)
VRTC: CRTC1.2 SIM4.28(VRTC)
NetESD10_2: ESD10.2 RSIM10.2 simcard1.C2(SIM_RST)
NetESD10_3: ESD10.3 RSIM11.2 simcard1.C3(SIM_CLK)
NetESD10_4: ESD10.4 RSIM13.2 simcard1.C7(SIM_DATA)
NetQsim6_2: Qsim6.2(B) Rsim4.2 Rsim5.2
NetQsim6_3: Qsim6.3(C) SIM4.39(PWRKEY)
NetRsimL_2: RsimL.2 SIM_LED.2
NetRVS1_1: RVS1.1 RVS2.2 USIM.5(ADJ)
NetSIM4_41: SIM4.41(NETLIGHT) SIM_LED.1

Not connected (* = marked no-connect by the designer): ESD10 6; SIM4 3(USART1_RTS)* 4(USART1_CTS)* 5(USART1_DCD)* 6(USART1_DTR)* 7(USART1_RI)* 9(MICP) 10(MICN) 11(SPKP)* 12(SPKN)* 14(SIM_DET)* 20(BT_ANT)* 22(USART2_TXD)* 23(USART2_RXD)* 24(USB_VBUS)* 25(USB_DP)* 26(USB_DN)* 29(RF_SYNC)* 38(ADC); simcard1 C6(VPP)*

### Notes on the sheet
- alireza roozitalab
- GSM_PART
- V1
- REV0.0

### Library data of the parts
CRTC1 CSIM10-CSIM13 CVS1 CVS4 CVS5 = Cap: Capacitor; Published: 8-Jun-2000; LatestRevisionDate: 17-Jul-2002; LatestRevisionNote: Re-released for DXP Platform.; PackageReference: RAD-0.3; Publisher: Altium Limited
CVS2 = Cap Pol1: Polarized Capacitor (Radial); Published: 8-Jun-2000; Revision: July-2002: Re-released for DXP Platform.; Publisher: Altium Limited; Value: 10uF
CVS3 = Cap Pol: Polar capacitor; ASiD Part Number: C-AS; Volte: 35v; Value: 470uf,6.3V
Qsim6 = 2N3904: NPN General Purpose Amplifier; pin to pad: 1>2 2>1; Published: 8-Jun-2000; LatestRevisionDate: 15-Jan-2003; LatestRevisionNote: PCB Footprint 'BCY-W3/D4.7' replaced; DatasheetDocument: 1997; PackageDocument: Sep-1998; PackageReference: TO-92A; Publisher: Altium Limited; Code_JEDEC: TO-92A; ComponentLink1Description: Manufacturer Link; ComponentLink1URL: http://www.fairchildsemi.com/; ComponentLink2Description: Datasheet; ComponentLink2URL: http://www.fairchildsemi.com/ds/2N%2F2N3904.pdf
Rsim1-Rsim5 RSIM10 RSIM11 RSIM13 RsimL = Res2: Resistor; Published: 8-Jun-2000; LatestRevisionDate: 17-Jul-2002; LatestRevisionNote: Re-released for DXP Platform.; PackageReference: AXIAL-0.4; Publisher: Altium Limited
  RSIM10 RSIM11 RSIM13: PackageDescription: Axial Device, Thru-Hole; 2 Leads; 0.4 in Pin Spacing
RVS1 = Res1: Resistor; Value: 1K; Published: 8-Jun-2000; Revision: July-2002: Re-released for DXP Platform.; Publisher: Altium Limited
RVS2 = Res1: Resistor; Published: 8-Jun-2000; Revision: July-2002: Re-released for DXP Platform.; Publisher: Altium Limited; Value: 1K
SIM_LED = Header 2: Header, 2-Pin; LatestRevisionDate: 17-Jul-2002; LatestRevisionNote: Re-released for DXP Platform.; Publisher: Altium Limited
SMB1 = SMB: SMB Straight Connector; LatestRevisionDate: 17-Jul-2002; LatestRevisionNote: Re-released for DXP Platform.; Publisher: Altium Limited

## Sheet OUTPUTS.SchDoc
size A; PageSetup: Record=PageOptions|CenterHorizontal=True|CenterVertical=True|PrintScale=1.04|XCorrection=1.00|YCorrection=1.00|PrintKind=2|BorderSize=5000000|LeftOffset=0|BottomOffset=0|Orientation=2|PaperLength=1000|PaperWidth=1000|Scale=100|PaperSource=7|PrintQuality=-3|MediaType=1|DitherType=10|PrintScaleMode=1|PaperKind=A4|PaperIndex=9
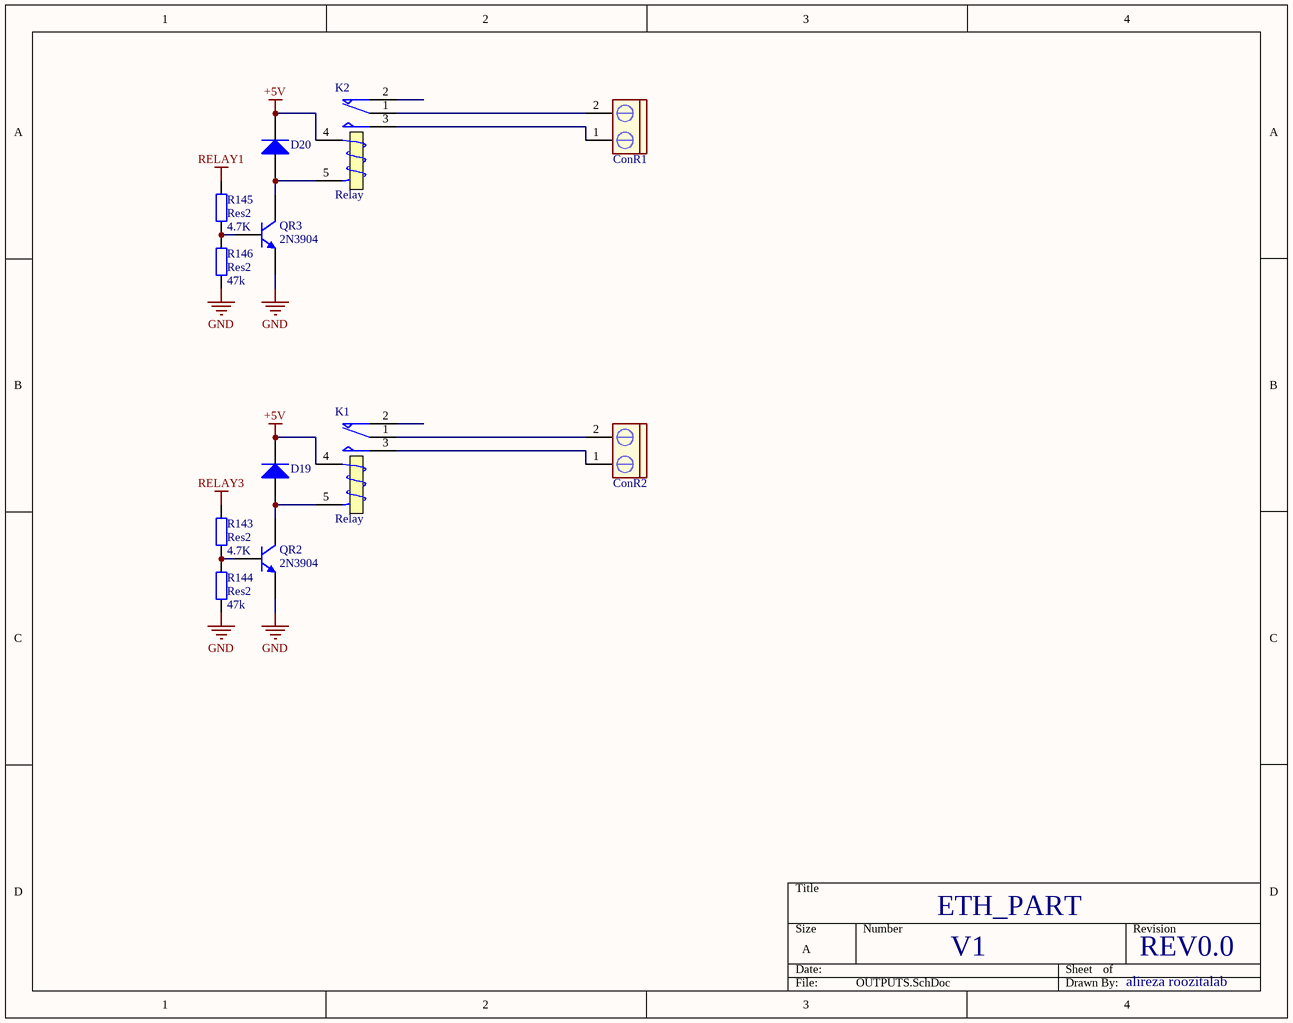
[diagram p5: OUTPUTS.SchDoc]

### Parts
ConR1  CON2 pin blue  [My_CN2]  (value not drawn)
ConR2  CON2 pin blue  [My_CN2]  (value not drawn)
D19  Diode 1N4148  [Diode-1n4148 - SMD PAD]  (value not drawn)
D20  Diode 1N4148  [Diode-1n4148 - SMD PAD]  (value not drawn)
K1  Relay  [Relay 18.85x15.35x15.70]
K2  Relay  [Relay 18.85x15.35x15.70]
QR2  2N3904  [2N3906_SMD]
QR3  2N3904  [2N3906_SMD]
R143  Res2  value 4.7K  [RES 1206 (3216X08L)]
R144  Res2  value 47k  [RES 1206 (3216X08L)]
R145  Res2  value 4.7K  [RES 1206 (3216X08L)]
R146  Res2  value 47k  [RES 1206 (3216X08L)]

### Nets
+5V: D19.2(K) D20.2(K) K1.4 K2.4(T1)
GND: QR2.1(E) QR3.1(E) R144.1 R146.1
RELAY1: R145.2  [project net PE5]
RELAY3: R143.2  [project net PE4]
NetConR1_1: ConR1.1 K2.3(NO)
NetConR1_2: ConR1.2 K2.1(COM)
NetConR2_1: ConR2.1 K1.3
NetConR2_2: ConR2.2 K1.1
NetD19_1: D19.1(A) K1.5 QR2.3(C)
NetD20_1: D20.1(A) K2.5(T2) QR3.3(C)
NetQR2_2: QR2.2(B) R143.1 R144.2
NetQR3_2: QR3.2(B) R145.1 R146.2

Not connected (* = marked no-connect by the designer): K1 2; K2 2(NC)

### Notes on the sheet
- ETH_PART
- V1
- REV0.0
- alireza roozitalab

### Library data of the parts
ConR1 ConR2 = CON2 pin blue: Connector blue screw
D19 D20 = Diode 1N4148: High Conductance Fast Diode; Published: 8-Jun-2000; LatestRevisionDate: 17-Jul-2002; LatestRevisionNote: Re-released for DXP Platform.; DatasheetDocument: 1997; PackageReference: DO-35; Publisher: Altium Limited; Code_JEDEC: DO-204-AH; ComponentLink1Description: Manufacturer Link; ComponentLink1URL: http://www.fairchildsemi.com/; ComponentLink2Description: Datasheet; ComponentLink2URL: http://www.fairchildsemi.com/ds/1N%2F1N4148.pdf
K1 K2 = Relay: SPDT Relay; Published: 8-Jun-2000; LatestRevisionDate: 17-Jul-2002; LatestRevisionNote: Re-released for DXP Platform.; PackageReference: MODULE5B; Publisher: Altium Limited
QR2 QR3 = 2N3904: NPN General Purpose Amplifier; pin to pad: 1>2 2>1; Published: 8-Jun-2000; LatestRevisionDate: 15-Jan-2003; LatestRevisionNote: PCB Footprint 'BCY-W3/D4.7' replaced; DatasheetDocument: 1997; PackageDocument: Sep-1998; PackageReference: TO-92A; Publisher: Altium Limited; Code_JEDEC: TO-92A; ComponentLink1Description: Manufacturer Link; ComponentLink1URL: http://www.fairchildsemi.com/; ComponentLink2Description: Datasheet; ComponentLink2URL: http://www.fairchildsemi.com/ds/2N%2F2N3904.pdf
R143-R146 = Res2: Resistor; Published: 8-Jun-2000; LatestRevisionDate: 17-Jul-2002; LatestRevisionNote: Re-released for DXP Platform.; PackageReference: AXIAL-0.4; Publisher: Altium Limited

## Nets that join several sheets
3V3: STM32F407VG (35 pins), POWER_PART (5 pins), PROTOCOL_PART (C325.2 R322.1 U37.8), ETH_PART (24 pins)
+5V: STM32F407VG (CAN1.3 Capcan1.2), POWER_PART (6 pins), PROTOCOL_PART (Crs3.1 Crs4.2 Urs2.16), SIM800 (USIM.1 USIM.2), OUTPUTS (D19.2 D20.2 K1.4 K2.4)
GND: STM32F407VG (43 pins), POWER_PART (13 pins), PROTOCOL_PART (10 pins), ETH_PART (17 pins), SIM800 (32 pins), OUTPUTS (QR2.1 QR3.1 R144.1 R146.1)
PE4: STM32F407VG (U1.3), OUTPUTS (R143.2)
PE5: STM32F407VG (U1.4), OUTPUTS (R145.2)
~{RESET}: STM32F407VG (5 pins), ETH_PART (U2.29)
PA1: STM32F407VG (U1.24), ETH_PART (R37.1)
PA2: STM32F407VG (U1.25), ETH_PART (U2.30)
PA7: STM32F407VG (U1.32), ETH_PART (R33.2 U2.40)
PA8: STM32F407VG (U1.67), ETH_PART (R36.1)
PA9: STM32F407VG (U1.68), SIM800 (simcard1.C8)
PB6: STM32F407VG (U1.92), SIM800 (Rsim2.1)
PB7: STM32F407VG (U1.93), SIM800 (Rsim1.2)
PB11: STM32F407VG (U1.48), ETH_PART (U2.2)
PB12: STM32F407VG (U1.51), ETH_PART (U2.3)
PB13: STM32F407VG (U1.52), ETH_PART (U2.4)
PB15: STM32F407VG (U1.54), PROTOCOL_PART (R321.2 U37.2 U37.3)
PC1: STM32F407VG (U1.16), ETH_PART (U2.31)
PC4: STM32F407VG (U1.33), ETH_PART (U2.43)
PC5: STM32F407VG (U1.34), ETH_PART (U2.44)
PD5: STM32F407VG (U1.86), PROTOCOL_PART (Urs2.11)
PD6: STM32F407VG (U1.87), PROTOCOL_PART (Urs2.12)
PD8: STM32F407VG (U1.55), PROTOCOL_PART (U37.4)
PD9: STM32F407VG (U1.56), PROTOCOL_PART (U37.1)
PE2: STM32F407VG (U1.1), SIM800 (Rsim4.1)
PE3: STM32F407VG (U1.2), SIM800 (SIM4.42)